# EAGLE design Xpander3-VIC (EAGLE 5.11)
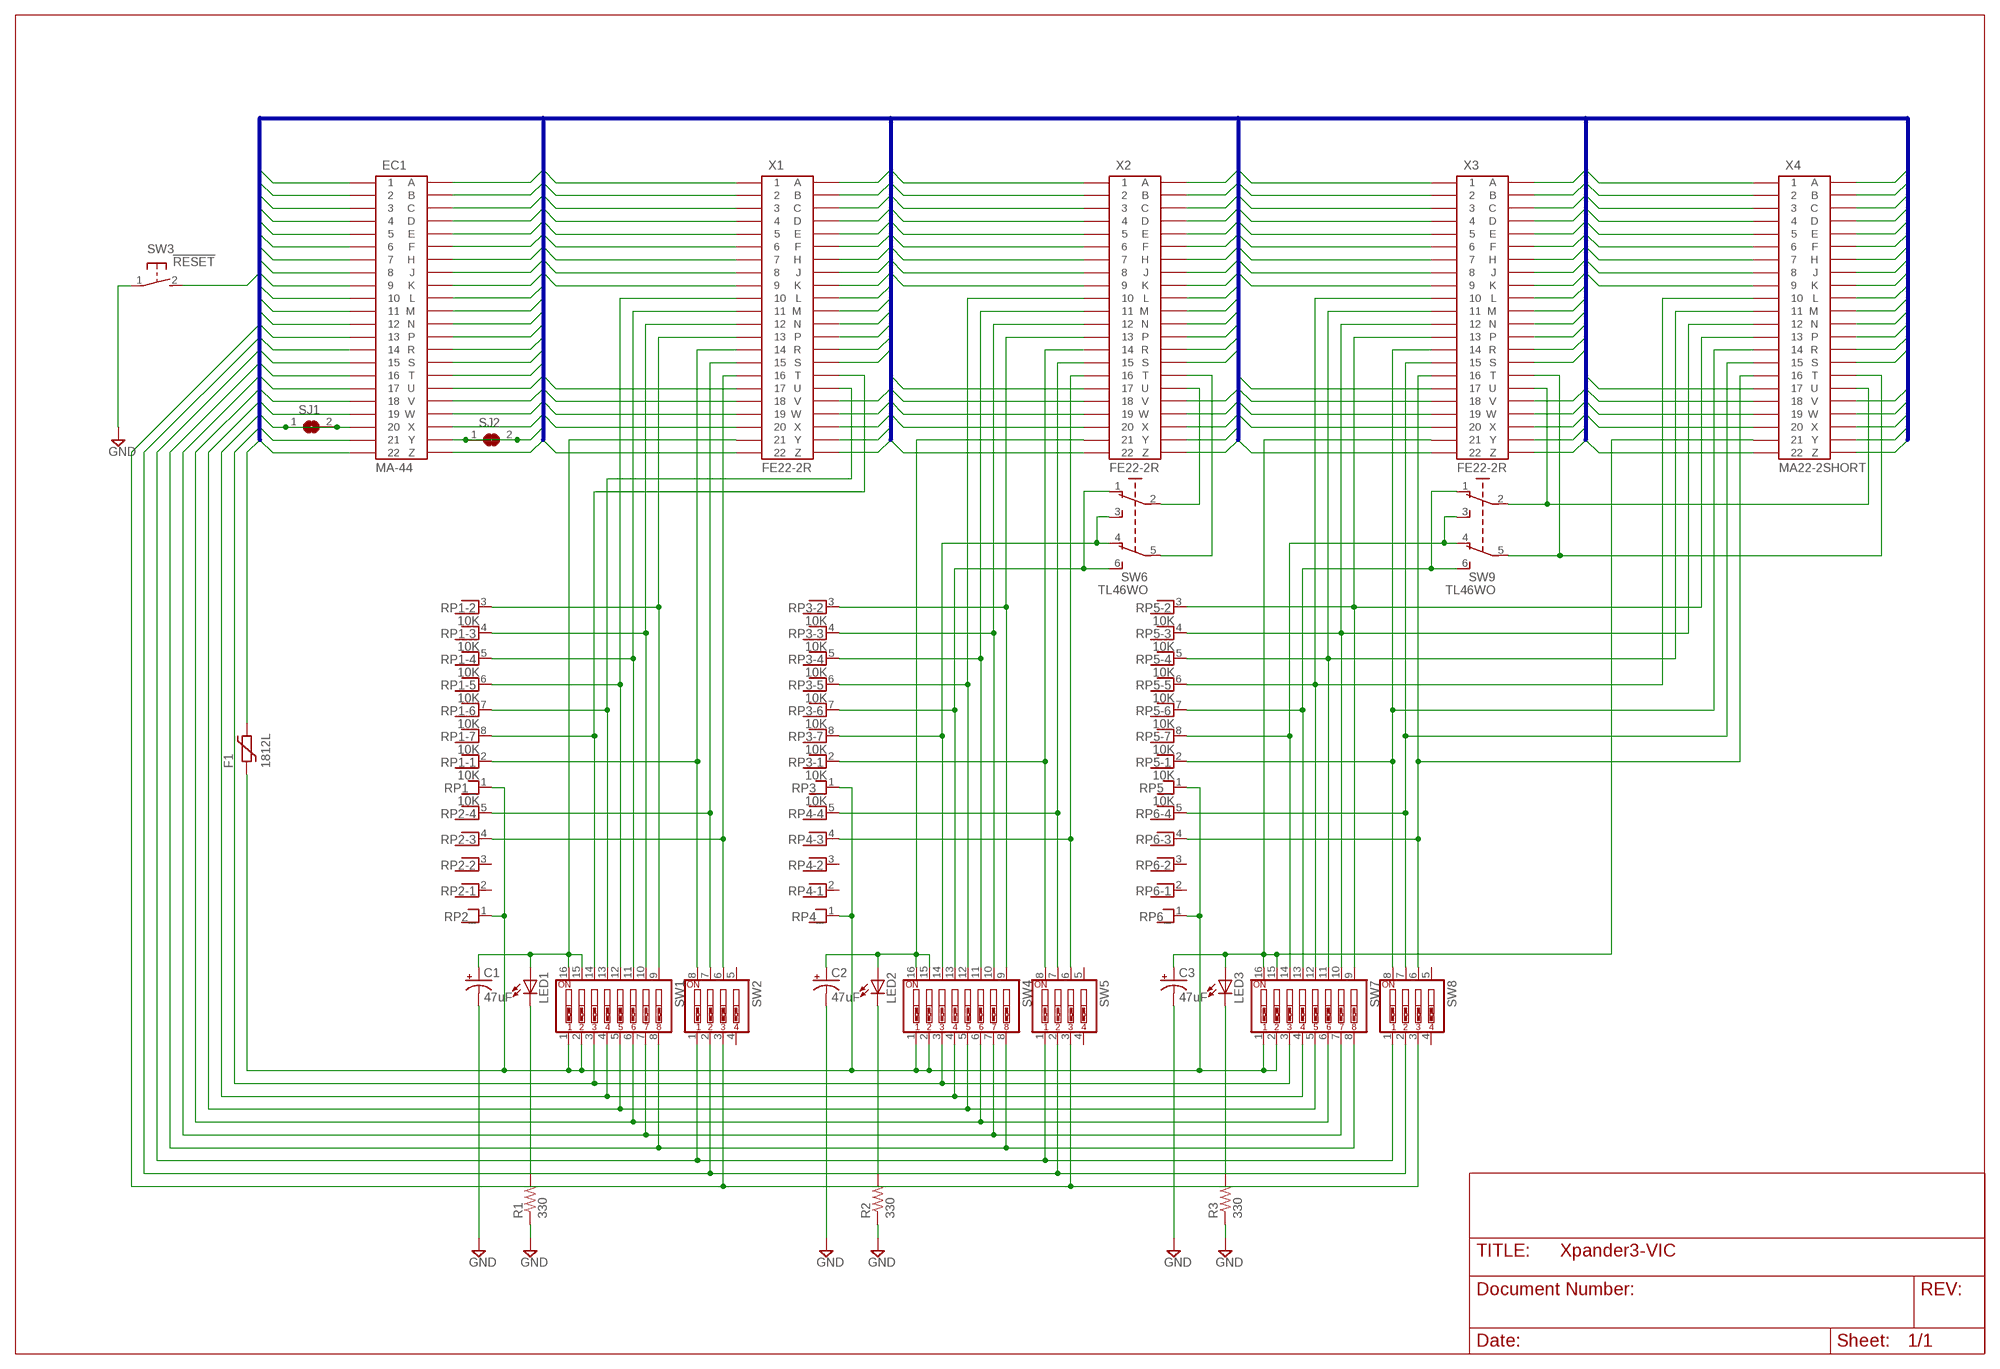
[diagram p0: schematic, sheet 1]

## Parts
C1  47uF  CPOL-USE2,5-6E  [E2,5-6E]
C2  47uF  CPOL-USE2,5-6E  [E2,5-6E]
C3  47uF  CPOL-USE2,5-6E  [E2,5-6E]
EC1  MA-44  [MA-44]
F1  1812L  [1812L]
LED1  LED3MM  [LED3MM]
LED2  LED3MM  [LED3MM]
LED3  LED3MM  [LED3MM]
R1  330  R-US_0204/7  [0204/7]
R2  330  R-US_0204/7  [0204/7]
R3  330  R-US_0204/7  [0204/7]
RP1  10K  RNX7  [RN-8]
RP2  RNX4  [RN-5]
RP3  10K  RNX7  [RN-8]
RP4  RNX4  [RN-5]
RP5  10K  RNX7  [RN-8]
RP6  RNX4  [RN-5]
SJ1  SJ  [SJ]
SJ2  SJ  [SJ]
SW1  SW_DIP-8  [EDG-08]
SW2  SW_DIP-4  [EDG-04]
SW3  !RESET  31-XX  [B3F-31XX]
SW4  SW_DIP-8  [EDG-08]
SW5  SW_DIP-4  [EDG-04]
SW6  TL46WO  [TL4XWO]
SW7  SW_DIP-8  [EDG-08]
SW8  SW_DIP-4  [EDG-04]
SW9  TL46WO  [TL4XWO]
X1  FE22-2R  [FE22-2_REV]
X2  FE22-2R  [FE22-2_REV]
X3  FE22-2R  [FE22-2_REV]
X4  MA22-2SHORT  [MA22-2SHORT]

## Nets
2: EC1.2 X1.2 X2.2 X3.2 X4.2
3: EC1.3 X1.3 X2.3 X3.3 X4.3
4: EC1.4 X1.4 X2.4 X3.4 X4.4
5: EC1.5 X1.5 X2.5 X3.5 X4.5
6: EC1.6 X1.6 X2.6 X3.6 X4.6
7: EC1.7 X1.7 X2.7 X3.7 X4.7
8: EC1.8 X1.8 X2.8 X3.8 X4.8
9: EC1.9 X1.9 X2.9 X3.9 X4.9
10: EC1.10 SW1.5 SW4.5 SW7.5
11: EC1.11 SW1.6 SW4.6 SW7.6
12: EC1.12 SW1.7 SW4.7 SW7.7
13: EC1.13 SW1.8 SW4.8 SW7.8
14: EC1.14 SW2.1 SW5.1 SW8.1
15: EC1.15 SW2.2 SW5.2 SW8.2
16: EC1.16 SW2.3 SW5.3 SW8.3
17: EC1.17 X1.17 X2.17 X3.17 X4.17
18: EC1.18 X1.18 X2.18 X3.18 X4.18
19: EC1.19 X1.19 X2.19 X3.19 X4.19
20: EC1.20 SJ1.1 SJ1.2 X1.20 X2.20 X3.20 X4.20
21: EC1.21 F1.P$2
B: EC1.B X1.B X2.B X3.B X4.B
C: EC1.C X1.C X2.C X3.C X4.C
D: EC1.D X1.D X2.D X3.D X4.D
E: EC1.E X1.E X2.E X3.E X4.E
F: EC1.F X1.F X2.F X3.F X4.F
FVCC: F1.P$1 RP1.1 RP2.1 RP3.1 RP4.1 RP5.1 RP6.1 SW1.1 SW1.2 SW4.1 SW4.2 SW7.1 SW7.2
GND: C1.- C2.- C3.- EC1.1 EC1.22 EC1.A EC1.Z R1.1 R2.1 R3.1 SW3.1(P) X1.1 X1.22 X1.A X1.Z X2.1 X2.22 X2.A X2.Z X3.1 X3.22 X3.A X3.Z X4.1 X4.22 X4.A X4.Z
H: EC1.H X1.H X2.H X3.H X4.H
J: EC1.J X1.J X2.J X3.J X4.J
K: EC1.K X1.K X2.K X3.K X4.K
L: EC1.L X1.L X2.L X3.L X4.L
M: EC1.M X1.M X2.M X3.M X4.M
N: EC1.N X1.N X2.N X3.N X4.N
N$1: RP1.6 SW1.12 X1.10
N$2: RP1.8 SW1.14 X1.T
N$3: RP1.7 SW1.13 X1.U
N$4: RP1.5 SW1.11 X1.11
N$5: RP1.4 SW1.10 X1.12
N$6: RP1.3 SW1.9 X1.13
N$7: C1.+ LED1.A SW1.15 SW1.16 X1.21
N$8: C2.+ LED2.A SW4.15 SW4.16 X2.21
N$9: RP3.6 SW4.12 X2.10
N$10: RP3.4 SW4.10 X2.12
N$11: RP5.2 SW8.8 X3.14 X4.14
N$12: RP3.7 SW4.13 SW6.1(O) SW6.6(S1)
N$13: RP3.8 SW4.14 SW6.3(S) SW6.4(O1)
N$14: RP6.5 SW8.7 X3.15 X4.15
N$15: RP3.3 SW4.9 X2.13
N$16: RP3.5 SW4.11 X2.11
N$17: LED1.K(C) R1.2
N$18: RP5.7 SW7.13 SW9.1(O) SW9.6(S1)
N$19: SW6.5(P1) X2.T
N$20: RP5.4 SW7.10 X3.12 X4.12
N$21: RP5.3 SW7.9 X3.13 X4.13
N$22: C3.+ LED3.A SW7.15 SW7.16 X3.21 X4.21
N$23: SW6.2(P) X2.U
N$24: RP5.8 SW7.14 SW9.3(S) SW9.4(O1)
N$25: LED2.K(C) R2.2
N$26: LED3.K(C) R3.2
N$27: SW9.2(P) X3.U X4.U
N$28: SW9.5(P1) X3.T X4.T
N$29: RP5.6 SW7.12 X3.10 X4.10
N$30: RP5.5 SW7.11 X3.11 X4.11
N$31: RP1.2 SW2.8 X1.14
N$32: RP2.5 SW2.7 X1.15
N$33: RP2.4 SW2.6 X1.16
N$34: RP3.2 SW5.8 X2.14
N$35: RP4.5 SW5.7 X2.15
N$36: RP4.4 SW5.6 X2.16
N$39: RP6.4 SW8.6 X3.16 X4.16
P: EC1.P X1.P X2.P X3.P X4.P
R: EC1.R X1.R X2.R X3.R X4.R
S: EC1.S X1.S X2.S X3.S X4.S
T: EC1.T SW1.3 SW4.3 SW7.3
U: EC1.U SW1.4 SW4.4 SW7.4
V: EC1.V X1.V X2.V X3.V X4.V
W: EC1.W X1.W X2.W X3.W X4.W
X: EC1.X SW3.2(S) X1.X X2.X X3.X X4.X
Y: EC1.Y SJ2.1 SJ2.2 X1.Y X2.Y X3.Y X4.Y
Unconnected: RP2.2 RP2.3 RP4.2 RP4.3 RP6.2 RP6.3 SW2.4 SW2.5 SW5.4 SW5.5 SW8.4 SW8.5

## Buses
GND,VCC,1,2,3,4,5,6,7,8,9,10,11,12,13,14,15,16,17,18,19,20,21,B,C,D,E,F,H,J,K,L,M,N,P,R,S,T,U,V,W,X,Y

## Library data of the parts
C1-C3 = rcl:CPOL-US: POLARIZED CAPACITOR, American symbol
EC1 = con-edge-156:MA-44: 44 PIN EDGE CONNECTOR FOR PCB
F1 = ptc-littlefuse:1812L
LED1-LED3 = led:LED: LED OSRAM: - CHIPLED LG R971, LG N971, LY N971, LG Q971, LY Q971, LO R971, LY R971 LH N974, LH R974 LS Q976, LO Q976, LY Q976 LO Q996 - Hyper CHIPLED LW Q18S LB Q993, LB Q99A, LB R99A - SideLED LS A670, LO A670, LY A670, LG A670, LP A670 LB A673, LV A673, LT A673, LW A673 LH A674 LY A675 LS A676, LA A676, LO A676, LY A676, LW A676 LS A679, LY A679, LG A679 - Hyper Micro SIDELED® LS Y876, LA Y876, LO Y876, LY Y876 LT Y87S - SmartLED LW L88C, LW L88S LB L89C, LB L89S, LG L890 LS L89K, LO L89K, LY L89K LS L896, LA L896, LO L896, LY L896 - TOPLED LS T670, LO T670, LY T670, LG T670, LP T670 LSG T670, LSP T670, LSY T670, LOP T670, LYG T670 LG T671, LOG T671, LSG T671 LB T673, LV T673, LT T673, LW T673 LH T674 LS T676, LA T676, LO T676, LY T676, LB T676, LH T676, LSB T676, LW T676 LB T67C, LV T67C, LT T67C, LS T67K, LO T67K, LY T67K, LW E67C LS E67B, LA E67B, LO E67B, LY E67B, LB E67C, LV E67C, LT E67C LW T67C LS T679, LY T679, LG T679 LS T770, LO T770, LY T770, LG T770, LP T770 LB T773, LV T773, LT T773, LW T773 LH T774 LS E675, LA E675, LY E675, LS T675 LS T776, LA T776, LO T776, LY T776, LB T776 LHGB T686 LT T68C, LB T68C - Hyper Mini TOPLED® LB M676 - Mini TOPLED Santana® LG M470 LS M47K, LO M47K, LY M47K Source: http://www.osram.convergy.de LUXEON: - LUMILED® LXK2-PW12-R00, LXK2-PW12-S00, LXK2-PW14-U00, LXK2-PW14-V00 LXK2-PM12-R00, LXK2-PM12-S00, LXK2-PM14-U00 LXK2-PE12-Q00, LXK2-PE12-R00, LXK2-PE12-S00, LXK2-PE14-T00, LXK2-PE14-U00 LXK2-PB12-K00, LXK2-PB12-L00, LXK2-PB12-M00, LXK2-PB14-N00, LXK2-PB14-P00, LXK2-PB14-Q00 LXK2-PR12-L00, LXK2-PR12-M00, LXK2-PR14-Q00, LXK2-PR14-R00 LXK2-PD12-Q00, LXK2-PD12-R00, LXK2-PD12-S00 LXK2-PH12-R00, LXK2-PH12-S00 LXK2-PL12-P00, LXK2-PL12-Q00, LXK2-PL12-R00 Source: www.luxeon.com KINGBRIGHT: KA-3528ASYC Source: www.kingbright.com
R1-R3 = rcl:R-US_: RESISTOR, American symbol
RP1 RP3 RP5 = resistor-net:RNX7: RESISTOR NETWORK; OC_FARNELL: unknown; OC_NEWARK: unknown
RP2 RP4 RP6 = resistor-net:RNX4: RESISTOR NETWORK; OC_FARNELL: unknown; OC_NEWARK: unknown
SJ1 SJ2 = jumper:SJ: SMD solder JUMPER
SW1 SW4 SW7 = special:SW_DIP-8: DIP SWITCH
SW2 SW5 SW8 = special:SW_DIP-4: DIP SWITCH
SW3 = switch-omron:31-XX: OMRON SWITCH; MPN: B3F-3100; OC_FARNELL: 959704; OC_NEWARK: 36M3582
SW6 SW9 = switch:TL46WO: TINY SWITCH ON - ON Source: http://www2.produktinfo.conrad.com/datenblaetter/700000-724999/705152-da-01-de-Subminiaturschalter_TL_36WO.pdf
X1-X3 = con-edge-156:FE22-2
X4 = con-edge-156:MA22-2SHORT

## Board
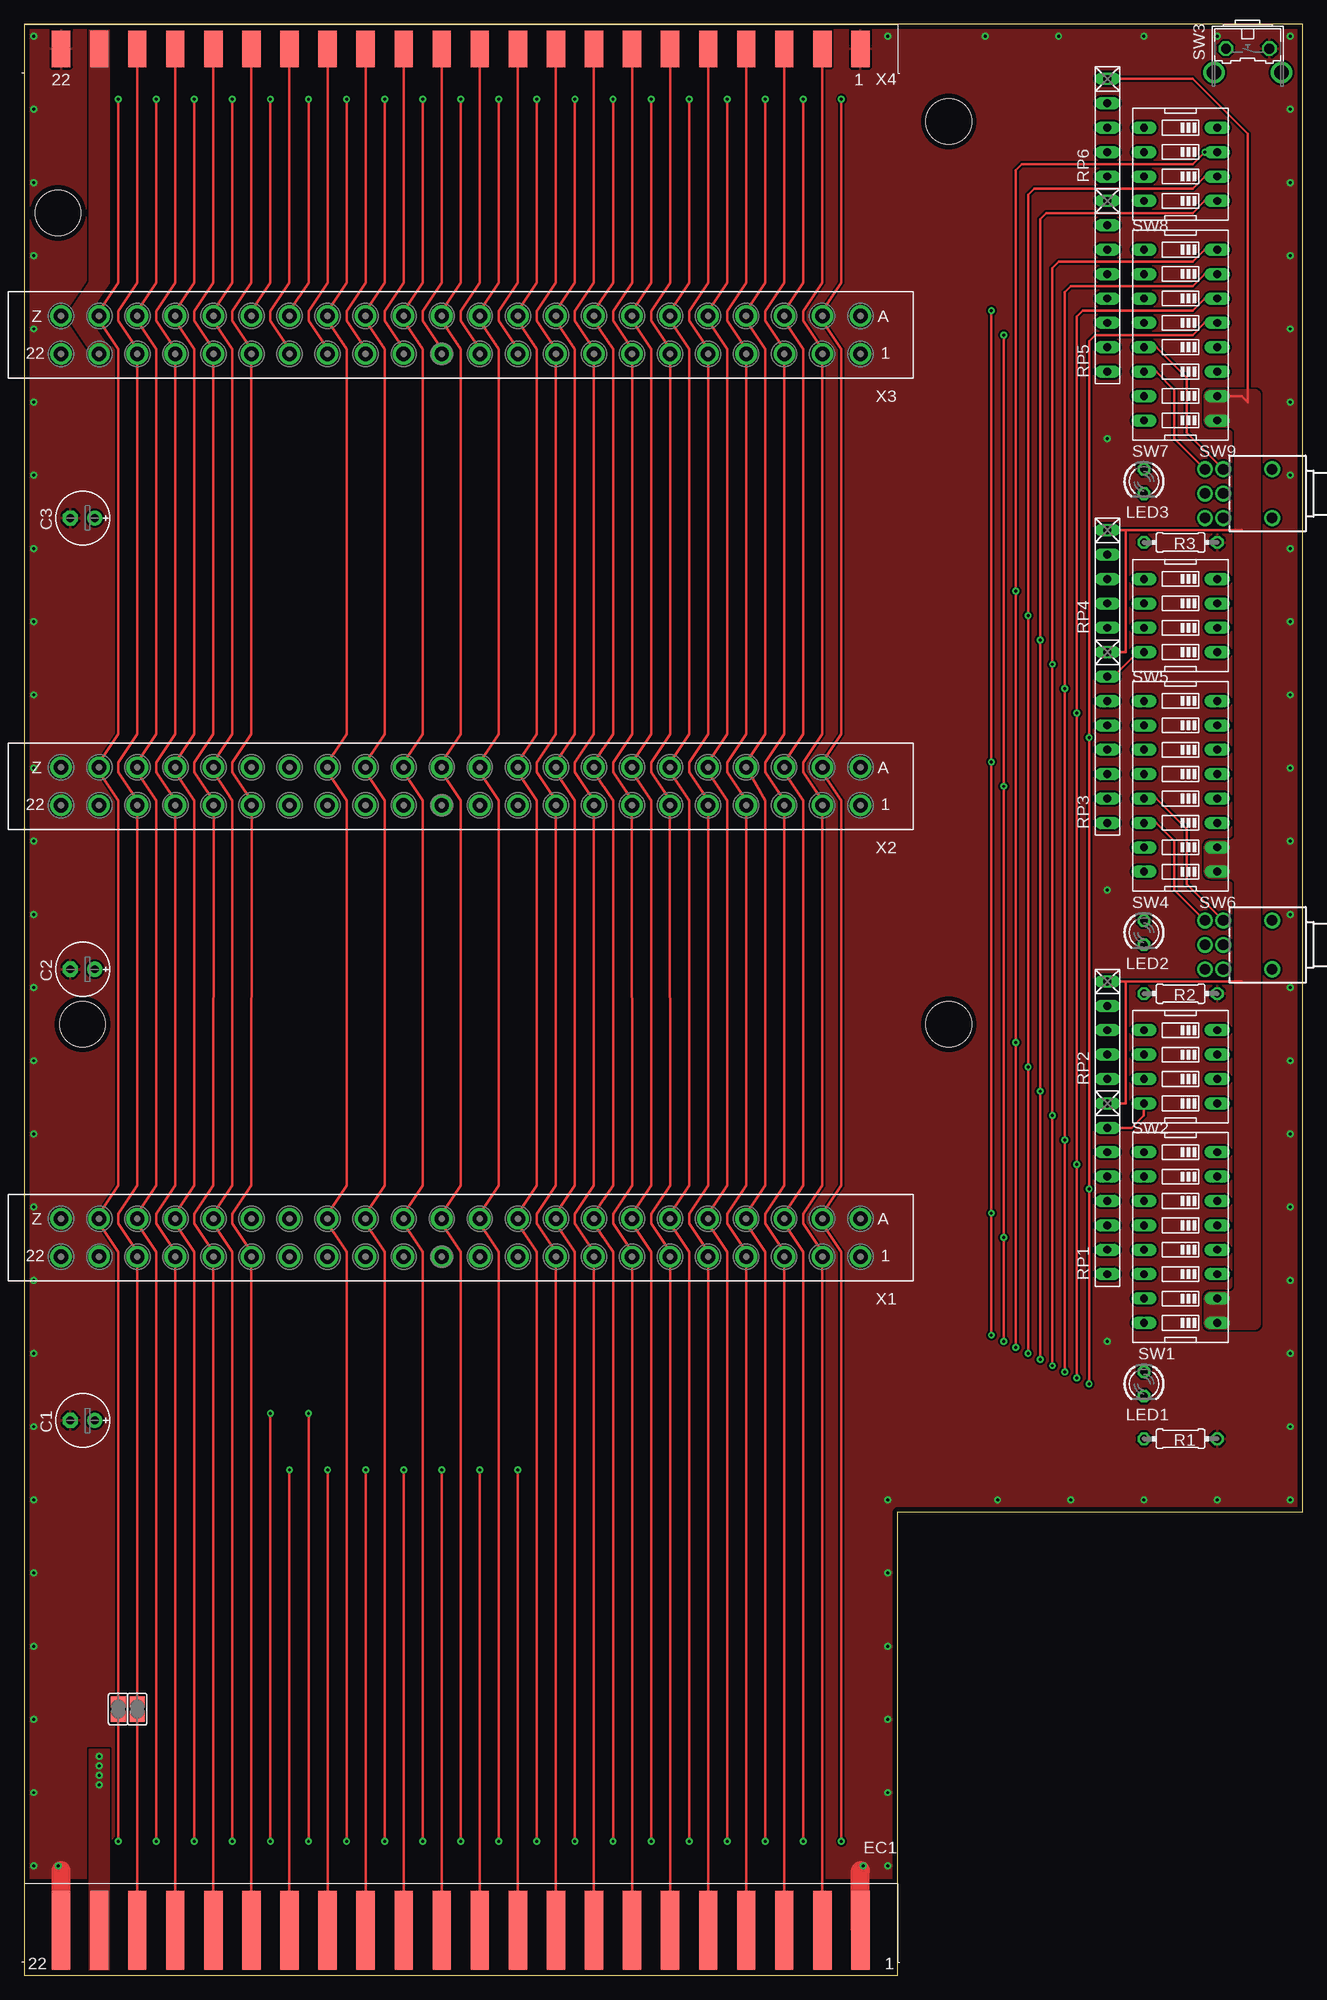
[diagram p1: board, top side]
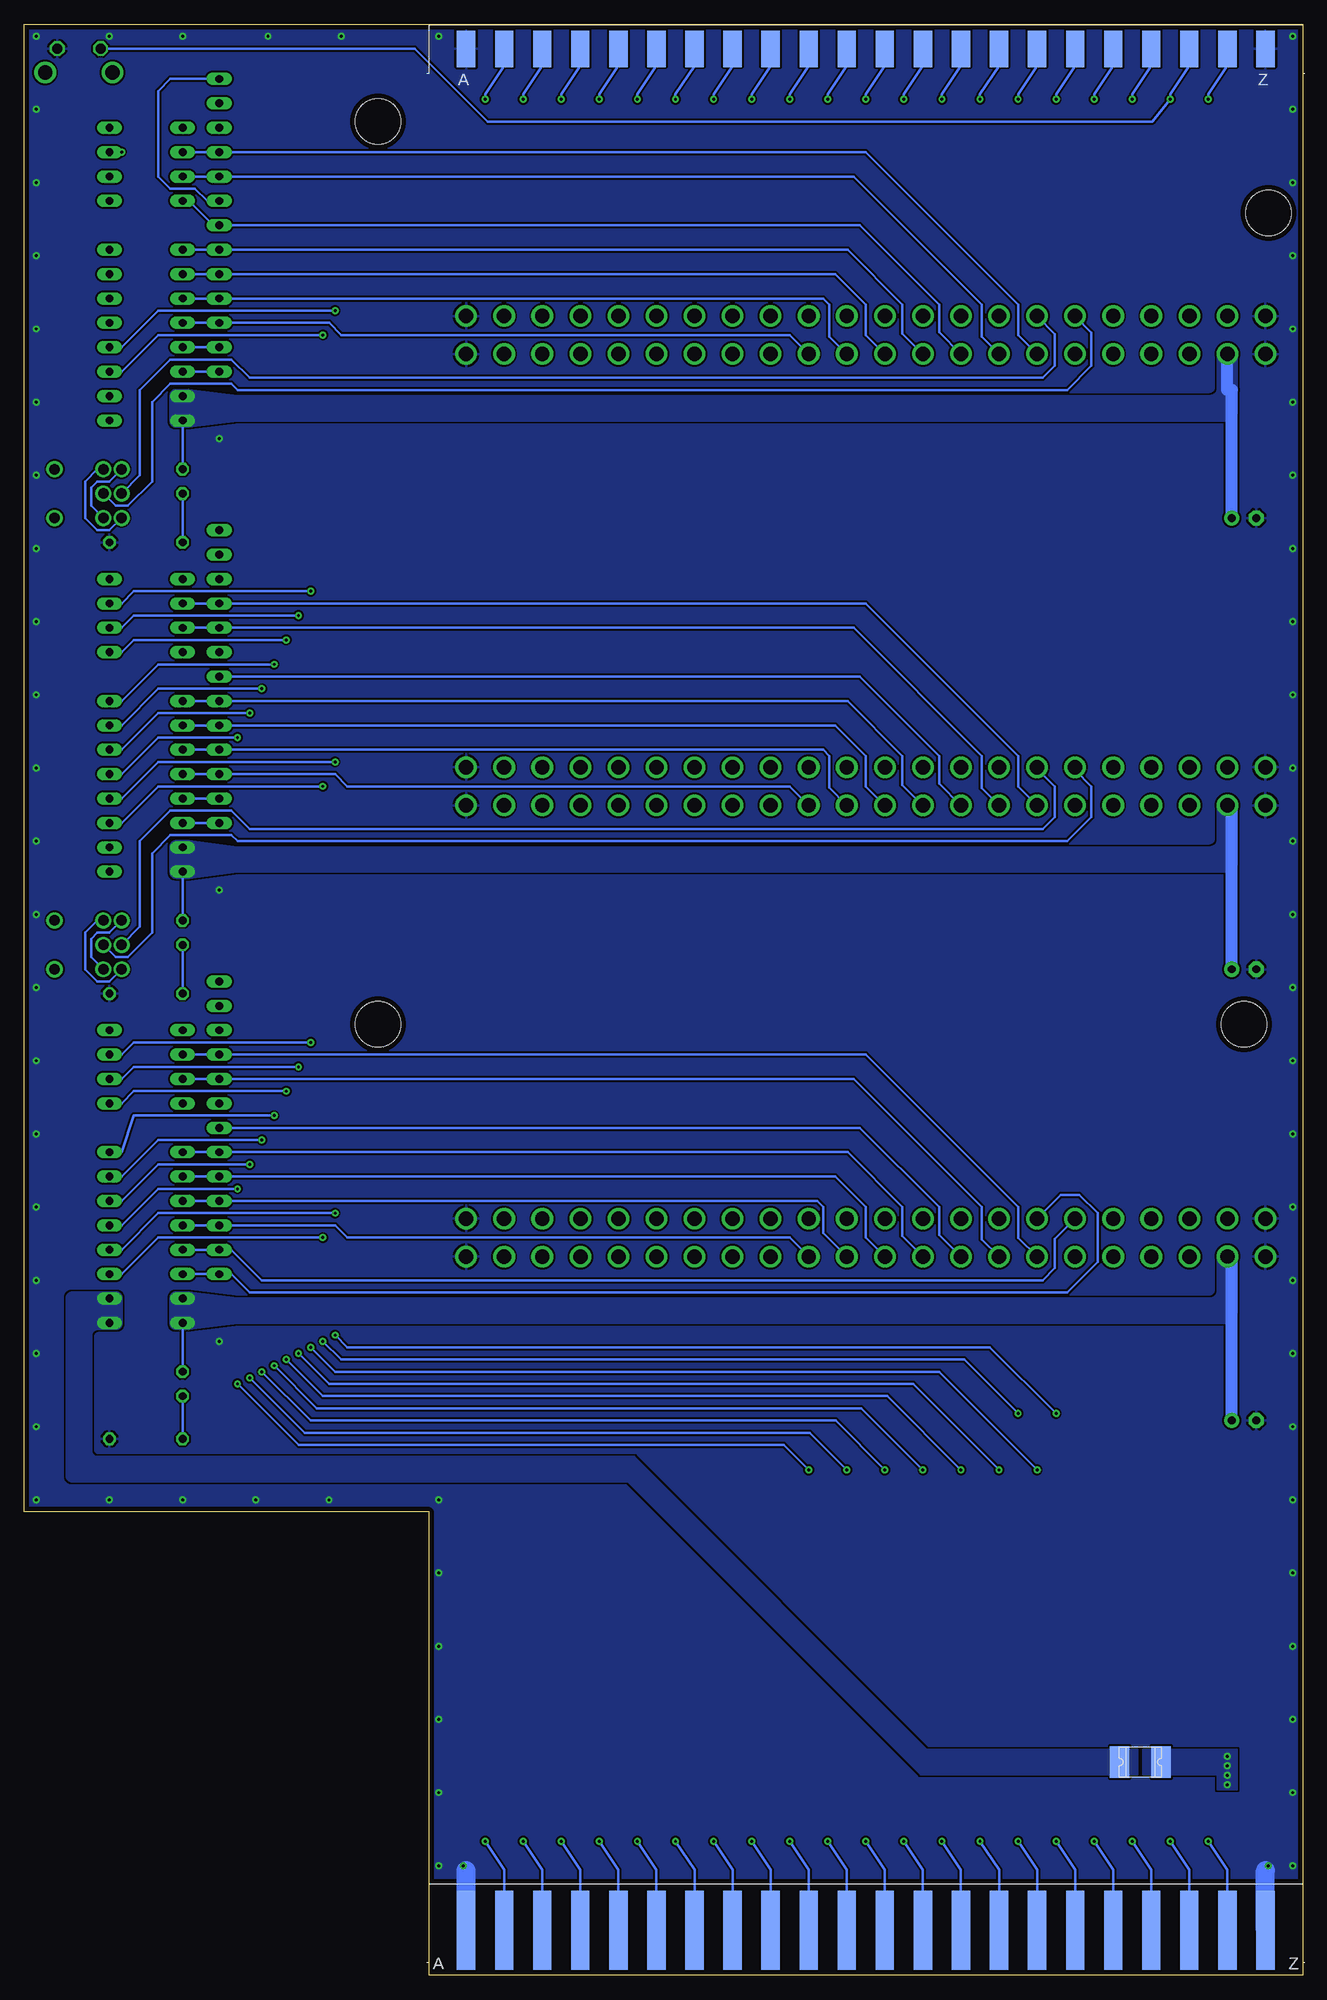
[diagram p2: board, bottom side, seen from below]

Size 133.1 x 203.2 mm. Coordinates in mm from the lower left corner, seen from the top.
Outline: 90.93,0 90.93,48.26 133.1,48.26 133.1,203.2 0,203.2 0,0 90.93,0
Copper layers (1*16): Top 0.035mm / dielectric 1.5mm / Bottom 0.035mm
Design rules "ourpcb-small *": minimum track width 8mil, minimum drill 12mil, track to track 8mil, track to pad 8mil, pad to pad 8mil, via to via 8mil, smd to smd 0mil, copper to edge 20mil, drill to drill 8mil, minimum pad ring 10mil, minimum via ring 8mil, stop-mask expansion 4mil, vias tented up to drill 0mil, thermal gap 10mil
Holes 4.75 mm at 96.27,99.06 96.27,193.04 3.56,183.51 6.1,99.06

### Footprints (pad centres in the part's own frame; a part is rotated, then mirrored left to right if it is on the bottom)
E2,5-6E = drill 0.813 pad 1.575 round: + -1.27,0 | drill 0.813 pad 1.575 octagon: - 1.27,0
MA-44 = smd 1.905 x 8.255: 1 -41.605,4.826; 2 -37.643,4.826; 3 -33.68,4.826; 4 -29.718,4.826; 5 -25.756,4.826; 6 -21.793,4.826; 7 -17.831,4.826; 8 -13.868,4.826; 9 -9.906,4.826; 10 -5.944,4.826; 11 -1.981,4.826; 12 1.981,4.826; 13 5.944,4.826; 14 9.906,4.826; 15 13.868,4.826; 16 17.831,4.826; 17 21.793,4.826; 18 25.756,4.826; 19 29.718,4.826; 20 33.68,4.826; 21 37.643,4.826; 22 41.605,4.826 | smd 1.905 x 8.255 bottom: A -41.605,4.826; B -37.643,4.826; C -33.68,4.826; D -29.718,4.826; E -25.756,4.826; F -21.793,4.826; H -17.831,4.826; J -13.868,4.826; K -9.906,4.826; L -5.944,4.826; M -1.981,4.826; N 1.981,4.826; P 5.944,4.826; R 9.906,4.826; S 13.868,4.826; T 17.831,4.826; U 21.793,4.826; V 25.756,4.826; W 29.718,4.826; X 33.68,4.826; Y 37.643,4.826; Z 41.605,4.826
1812L = smd 2.03 x 3.3: P$1 -2.16,0; P$2 2.16,0
LED3MM = drill 0.813 octagon: A -1.27,0; K 1.27,0
0204/7 = drill 0.813 octagon: 1 -3.81,0; 2 3.81,0
RN-8 = drill 0.813 long: 1 -8.89,0; 2 -6.35,0; 3 -3.81,0; 4 -1.27,0; 5 1.27,0; 6 3.81,0; 7 6.35,0; 8 8.89,0
RN-5 = drill 0.813 long: 1 -5.08,0; 2 -2.54,0; 3 0,0; 4 2.54,0; 5 5.08,0
SJ = smd 1.168 x 1.6: 1 -0.762,0; 2 0.762,0
EDG-08 = drill 0.813 long: 1 -8.89,-3.81; 2 -6.35,-3.81; 3 -3.81,-3.81; 4 -1.27,-3.81; 5 1.27,-3.81; 6 3.81,-3.81; 7 6.35,-3.81; 8 8.89,-3.81; 9 8.89,3.81; 10 6.35,3.81; 11 3.81,3.81; 12 1.27,3.81; 13 -1.27,3.81; 14 -3.81,3.81; 15 -6.35,3.81; 16 -8.89,3.81
EDG-04 = drill 0.813 long: 1 -3.81,-3.81; 2 -1.27,-3.81; 3 1.27,-3.81; 4 3.81,-3.81; 5 3.81,3.81; 6 1.27,3.81; 7 -1.27,3.81; 8 -3.81,3.81
B3F-31XX = drill 1.016 octagon: 1 -2.261,-1.245; 2 2.261,-1.245 | drill 1.499 pad 2.159 round: 3 -3.505,1.245; 4 3.505,1.245
TL4XWO = drill 1.1 pad 1.422 round: 1 -2.54,-5.08; 2 0,-5.08; 3 2.54,-5.08; 4 -2.54,-6.985; 5 0,-6.985; 6 2.54,-6.985 | drill 1.1 pad 1.676 round: M1 -2.54,0; M2 2.54,0
FE22-2_REV = drill 1.5 round: 1 -41.605,1.981; 2 -37.643,1.981; 3 -33.68,1.981; 4 -29.718,1.981; 5 -25.756,1.981; 6 -21.793,1.981; 7 -17.831,1.981; 8 -13.868,1.981; 9 -9.906,1.981; 10 -5.944,1.981; 11 -1.981,1.981; 12 1.981,1.981; 13 5.944,1.981; 14 9.906,1.981; 15 13.868,1.981; 16 17.831,1.981; 17 21.793,1.981; 18 25.756,1.981; 19 29.718,1.981; 20 33.68,1.981; 21 37.644,1.958; 22 41.605,1.98; A -41.605,-1.981; B -37.643,-1.981; C -33.68,-1.981; D -29.718,-1.981; E -25.756,-1.981; F -21.793,-1.981; H -17.831,-1.981; J -13.868,-1.981; K -9.906,-1.981; L -5.944,-1.981; M -1.981,-1.981; N 1.981,-1.981; P 5.944,-1.981; R 9.906,-1.981; S 13.868,-1.981; T 17.831,-1.981; U 21.793,-1.981; V 25.756,-1.981; W 29.718,-1.981; X 33.68,-1.981; Y 37.643,-1.981; Z 41.605,-1.981
MA22-2SHORT = smd 1.905 x 3.81: 1 -41.605,0; 2 -37.643,0; 3 -33.68,0; 4 -29.718,0; 5 -25.756,0; 6 -21.793,0; 7 -17.831,0; 8 -13.868,0; 9 -9.906,0; 10 -5.944,0; 11 -1.981,0; 12 1.981,0; 13 5.944,0; 14 9.906,0; 15 13.868,0; 16 17.831,0; 17 21.793,0; 18 25.756,0; 19 29.718,0; 20 33.68,0; 21 37.643,0; 22 41.605,0 | smd 1.905 x 3.81 bottom: A -41.605,0; B -37.643,0; C -33.68,0; D -29.718,0; E -25.756,0; F -21.793,0; H -17.831,0; J -13.868,0; K -9.906,0; L -5.944,0; M -1.981,0; N 1.981,0; P 5.944,0; R 9.906,0; S 13.868,0; T 17.831,0; U 21.793,0; V 25.756,0; W 29.718,0; X 33.68,0; Y 37.643,0; Z 41.605,0

### Placement (x,y rotation side)
C1  6.1,57.78 180 top
C2  6.1,104.78 180 top
C3  6.1,151.76 180 top
EC1  45.47,9.53 180 top
F1  16.89,22.23 0 bottom
LED1  116.59,61.59 270 top
LED2  116.59,108.58 270 top
LED3  116.59,155.57 270 top
R1  120.4,55.88 180 top
R2  120.4,102.23 180 top
R3  120.4,149.22 180 top
RP1  112.78,81.92 270 top
RP2  112.78,98.42 270 top
RP3  112.78,128.91 270 top
RP4  112.78,145.41 270 top
RP5  112.78,175.9 270 top
RP6  112.78,192.41 270 top
SJ1  11.79,27.74 270 top
SJ2  9.8,27.74 270 top
SW1  120.4,76.83 90 top
SW2  120.4,94.61 90 top
SW3  127.38,199.39 180 top
SW4  120.4,123.83 90 top
SW5  120.4,141.6 90 top
SW6  129.92,107.31 270 top
SW7  120.4,170.81 90 top
SW8  120.4,188.59 90 top
SW9  129.92,154.31 270 top
X1  45.47,76.83 180 top
X2  45.47,123.83 180 top
X3  45.47,170.81 180 top
X4  45.47,200.61 180 top

### Tracks (layer width: path | path; a pad name or v marks a point on that pad's centre or on a via)
2
  Top 0.254: X4.2 83.11,176.26 81.13,173.29 81.13,172.3 83.11,169.33 X3.2 83.11,129.27 81.13,126.3 81.13,125.31 83.11,122.34 X2.2 83.11,82.28 81.13,79.31 81.13,78.32 83.11,75.35 83.09,75.33 X1.2 83.09,74.38 83.11,74.36 EC1.2
3
  Top 0.254: X4.3 79.15,176.26 77.16,173.29 77.16,172.3 79.15,169.33 X3.3 79.15,129.27 77.16,126.3 77.16,125.31 79.15,122.34 X2.3 79.13,121.37 79.15,82.28 77.16,79.31 77.16,78.32 79.15,75.35 79.13,75.33 X1.3 79.13,74.38 79.15,74.36 EC1.3
4
  Top 0.254: X4.4 75.18,176.26 73.2,173.29 73.2,172.3 75.18,169.33 X3.4 75.18,129.27 73.2,126.3 73.2,125.31 75.18,122.34 X2.4 75.17,121.37 75.18,82.28 73.2,79.31 73.2,78.32 75.18,75.35 75.17,75.33 X1.4 75.17,74.38 75.18,74.36 EC1.4
5
  Top 0.254: X4.5 71.22,176.26 69.24,173.29 69.24,172.3 71.22,169.33 X3.5 71.22,129.27 69.24,126.3 69.24,125.31 71.22,122.34 X2.5 71.21,121.36 71.22,82.28 69.24,79.31 69.24,78.32 71.22,75.35 71.21,75.33 X1.5 71.21,74.37 71.22,74.36 EC1.5
6
  Top 0.254: X4.6 67.26,176.26 65.28,173.29 65.28,172.3 67.26,169.33 X3.6 67.26,129.27 65.28,126.3 65.28,125.31 67.26,122.34 X2.6 67.25,121.36 67.26,82.28 65.28,79.31 65.28,78.32 67.26,75.35 67.25,75.34 X1.6 67.25,74.37 67.26,74.36 EC1.6
7
  Top 0.254: X4.7 63.3,176.26 61.32,173.29 61.32,172.3 63.3,169.33 X3.7 63.3,129.27 61.32,126.3 61.32,125.31 63.3,122.34 X2.7 63.29,121.36 63.3,82.28 61.32,79.31 61.32,78.32 63.3,75.35 X1.7 63.29,74.37 63.3,74.36 EC1.7
8
  Top 0.254: X4.8 59.33,176.26 57.35,173.29 57.35,172.3 59.33,169.33 X3.8 59.33,129.27 57.35,126.3 57.35,125.31 59.33,122.34 X2.8 59.33,121.36 59.33,82.28 57.35,79.31 57.35,78.32 59.33,75.35 59.33,75.34 X1.8 59.33,74.37 59.33,74.36 EC1.8
9
  Top 0.254: X4.9 55.37,176.26 53.39,173.29 53.39,172.3 55.37,169.33 X3.9 55.37,129.27 53.39,126.3 53.39,125.31 55.37,122.34 X2.9 55.37,82.28 53.39,79.31 53.39,78.32 55.37,75.35 X1.9 55.37,74.36 EC1.9
10  (via drill 0.3)
  Top 0.254: v51.41,52.65 EC1.10 | v110.87,61.59 v110.87,81.92 v110.87,128.91 110.87,170.18 111.51,170.81 121.67,170.81 122.94,172.09 SW7.5
  Bottom 0.254: v110.87,61.59 104.52,55.24 54,55.24 v51.41,52.65 | SW1.5 122.94,78.11 119.13,81.92 v110.87,81.92 | SW4.5 122.94,125.09 119.13,128.91 v110.87,128.91
11  (via drill 0.3)
  Top 0.254: v47.45,52.65 EC1.11 | v109.6,62.23 v109.6,84.45 v109.6,131.44 109.6,172.72 110.24,173.35 121.67,173.35 122.94,174.62 SW7.6
  Bottom 0.254: v109.6,62.23 103.89,56.52 51.31,56.52 v47.45,52.65 | SW1.6 122.94,80.64 119.13,84.45 v109.6,84.45 | SW4.6 122.94,127.64 119.13,131.44 v109.6,131.44
12  (via drill 0.3)
  Top 0.254: v43.48,52.65 EC1.12 | v108.33,62.87 v108.33,87 v108.33,133.99 108.33,175.26 108.97,175.9 121.67,175.9 122.94,177.16 SW7.7
  Bottom 0.254: v108.33,62.87 103.25,57.78 48.62,57.78 v43.48,52.65 | SW1.7 122.94,83.19 119.13,87 v108.33,87 | SW4.7 122.94,130.18 119.13,133.99 v108.33,133.99
13  (via drill 0.3)
  Top 0.254: v39.52,52.65 EC1.13 | v107.06,63.5 v107.06,89.53 v107.06,136.53 107.06,177.8 107.7,178.44 121.67,178.44 122.94,179.71 SW7.8
  Bottom 0.254: v107.06,63.5 102.62,59.05 45.92,59.05 v39.52,52.65 | SW1.8 122.94,85.72 121.67,89.53 v107.06,89.53 | SW4.8 122.94,132.72 119.13,136.53 v107.06,136.53
14  (via drill 0.3)
  Top 0.254: v35.56,52.65 EC1.14 | v105.79,64.14 v105.79,92.08 v105.79,139.06 105.79,182.88 106.43,183.51 121.67,183.51 122.94,184.78 SW8.1
  Bottom 0.254: v105.79,64.14 101.98,60.33 43.23,60.33 v35.56,52.65 | SW2.1 122.94,90.81 121.67,92.08 v105.79,92.08 | SW5.1 122.94,137.79 121.67,139.06 v105.79,139.06
15  (via drill 0.3)
  Top 0.254: v31.6,52.65 EC1.15 | v104.52,64.77 v104.52,94.61 v104.52,141.6 104.52,185.42 105.16,186.06 121.67,186.06 122.94,187.32 SW8.2
  Bottom 0.254: v104.52,64.77 101.35,61.59 40.54,61.59 v31.6,52.65 | SW2.2 122.94,93.34 121.67,94.61 v104.52,94.61 | SW5.2 122.94,140.34 121.67,141.6 v104.52,141.6
16  (via drill 0.3)
  Top 0.254: v27.63,52.65 EC1.16 | v103.25,65.41 v103.25,97.16 v103.25,144.15 103.25,187.96 103.89,188.59 121.67,188.59 v122.94,189.87
  Bottom 0.254: v103.25,65.41 100.71,62.87 37.85,62.87 v27.63,52.65 | SW2.3 122.94,95.89 121.67,97.16 v103.25,97.16 | SW5.3 122.94,142.88 121.67,144.15 v103.25,144.15 | v122.94,189.87 SW8.3
17
  Top 0.254: X4.17 23.67,176.26 21.69,173.29 21.69,172.3 23.67,169.33 X3.17 23.67,129.27 21.69,126.3 21.69,125.31 23.67,122.34 X2.17 23.69,121.36 23.67,82.28 21.69,79.31 21.69,78.32 23.67,75.35 23.69,75.34 X1.17 23.69,74.37 23.67,74.36 EC1.17
18
  Top 0.254: X4.18 19.71,176.26 17.73,173.29 17.73,172.3 19.71,169.33 X3.18 19.71,129.27 17.73,126.3 17.73,125.31 19.71,122.34 X2.18 19.73,121.36 19.71,82.28 17.73,79.31 17.73,78.32 19.71,75.35 19.73,75.33 X1.18 19.73,74.37 19.71,74.36 EC1.18
19
  Top 0.254: X4.19 15.75,176.26 13.77,173.29 13.77,172.3 15.75,169.33 X3.19 15.75,129.27 13.77,126.3 13.77,125.31 15.75,122.34 X2.19 15.77,121.37 15.75,82.28 13.77,79.31 13.77,78.32 15.75,75.35 X1.19 15.77,74.38 15.75,74.36 EC1.19
20
  Top 0.254: X4.20 11.79,176.26 9.8,173.29 9.8,172.3 11.79,169.33 X3.20 11.79,129.27 9.8,126.3 9.8,125.31 11.79,122.34 X2.20 11.81,121.37 11.79,82.28 9.8,79.31 9.8,78.32 11.79,75.35 X1.20 11.81,74.38 11.79,74.36 SJ1.1 SJ1.2 EC1.20
21  (via drill 0.3)
  other vias: 7.82,22.83 7.82,21.84 7.82,20.85 7.82,19.86
  pour Top (no thermals): 6.83,0.55 8.81,0.55 8.81,23.5 6.83,23.5
  pour Bottom (no thermals): 16.57,23.5 6.83,23.5 6.83,19.37 8.81,19.37 8.81,20.95 16.57,20.95
B  (via drill 0.3)
  Top 0.254: v85.09,195.38 85.09,176.26 83.11,173.29 X3.B 83.11,172.3 85.09,169.33 85.09,129.27 83.11,126.3 X2.B 83.09,125.33 83.11,125.31 85.09,122.34 85.09,82.28 83.11,79.31 83.09,79.29 X1.B 83.09,78.34 83.11,78.32 85.09,75.35 v85.09,13.97
  Bottom 0.254: 82.93,201.12 arc-90 83.09,200.96 X4.B 83.11,198.84 85.09,195.87 v85.09,195.38 | v85.09,13.97 83.11,11 EC1.B
C  (via drill 0.3)
  Top 0.254: v81.13,195.38 81.13,176.26 79.15,173.29 X3.C 79.15,172.3 81.13,169.33 81.13,129.27 79.15,126.3 X2.C 79.15,125.31 81.13,122.34 81.13,82.28 79.15,79.31 X1.C 79.13,78.34 79.15,78.32 81.13,75.35 v81.13,13.97
  Bottom 0.254: v81.13,195.38 81.13,195.87 79.15,198.84 X4.C | v81.13,13.97 79.15,11 EC1.C
D  (via drill 0.3)
  Top 0.254: v77.16,195.38 77.16,176.26 75.18,173.29 X3.D 75.18,172.3 77.16,169.33 77.16,129.27 75.18,126.3 X2.D 77.16,122.34 77.16,82.28 75.18,79.31 X1.D 75.17,78.34 75.18,78.32 77.16,75.35 v77.16,13.97
  Bottom 0.254: X4.D arc90 75.17,200.64 75.18,198.84 77.16,195.87 v77.16,195.38 | v77.16,13.97 75.18,11 EC1.D
E  (via drill 0.3)
  Top 0.254: v73.2,195.38 73.2,176.26 71.22,173.29 X3.E 71.22,172.3 73.2,169.33 73.2,129.27 71.22,126.3 X2.E 71.21,125.33 71.22,125.31 73.2,122.34 73.2,82.28 71.22,79.31 X1.E 71.21,78.34 71.22,78.32 73.2,75.35 v73.2,13.97
  Bottom 0.254: X4.E arc90 71.21,200.64 71.22,198.84 73.2,195.87 v73.2,195.38 | v73.2,13.97 71.22,11 EC1.E
F  (via drill 0.3)
  Top 0.254: v69.24,195.38 69.24,176.26 67.26,173.29 X3.F 67.26,172.3 69.24,169.33 69.24,129.27 67.26,126.3 X2.F 67.26,125.31 69.24,122.34 69.24,82.28 67.26,79.31 X1.F 67.25,78.33 67.26,78.32 69.24,75.35 v69.24,13.97
  Bottom 0.254: X4.F arc90 67.25,200.65 67.26,198.84 69.24,195.87 v69.24,195.38 | v69.24,13.97 67.26,11 EC1.F
FVCC
  Top 0.254: RP1.1 114.68,90.81 114.68,103.5 | RP3.1 114.68,137.79 114.68,150.5 | RP4.1 114.68,150.5 | 114.68,150.5 126.75,150.5 | 114.68,103.5 RP2.1 | 114.68,103.5 126.75,103.5 | SW7.2 126.75,164.47 127.38,163.83 127.38,191.77 121.67,197.49 RP6.1
  Bottom 0.254: RP5.1 114.05,184.78 115.32,186.06 117.86,186.06 119.13,187.32 119.13,196.22 117.86,197.49 RP6.1
  pour Bottom (no thermals): 17.21,23.5 39.12,23.5 69.6,53.98 125.48,53.98 arc90 126.11,54.61 126.11,66.67 arc90 125.48,67.31 123.57,67.31 arc-90 122.94,67.94 122.94,70.48 arc-90 123.57,71.12 128.02,71.12 arc-90 128.65,70.48 128.65,52.07 arc-90 128.02,51.44 70.23,51.44 39.75,20.95 17.21,20.95
  pour Top (no thermals): 123.57,67.31 arc-90 122.94,67.94 122.94,70.48 arc-90 123.57,71.12 125.48,71.12 arc90 126.11,71.75 126.11,113.67 arc90 125.48,114.3 123.57,114.3 arc-90 122.94,114.94 122.94,117.47 arc-90 123.57,118.11 125.48,118.11 arc90 126.11,118.75 126.11,160.66 arc90 125.48,161.29 123.57,161.29 arc-90 122.94,161.93 122.94,164.47 arc-90 123.57,165.1 128.02,165.1 arc-90 128.65,164.47 128.65,67.94 arc-90 128.02,67.31
GND  (via drill 0.3)
  Top 1.981: EC1.1 87.07,10.95 | EC1.Z 3.86,10.95
  Bottom 1.981: EC1.1 87.07,10.95 | EC1.Z 3.86,10.95
  other vias: 112.78,160.02 131.83,201.93 131.83,194.31 131.83,186.69 131.83,179.07 131.83,171.45 131.83,163.83 131.83,148.59 131.83,156.21 131.83,140.97 131.83,133.35 131.83,125.73 131.83,118.11 131.83,110.49 131.83,102.87 131.83,95.25 131.83,87.63 131.83,80.01 131.83,72.39 131.83,64.77 131.83,57.15 131.83,49.53 124.21,49.53 116.59,49.53 108.97,49.53 101.35,49.53 89.92,26.67 89.92,19.05 89.92,11.43 1.02,11.43 1.02,19.05 1.02,26.67 1.02,49.53 1.02,57.15 1.02,64.77 1.02,72.39 1.02,80.01 1.02,87.63 1.02,95.25 1.02,102.87 1.02,110.49 1.02,118.11 1.02,125.73 1.02,133.35 1.02,140.97 1.02,148.59 1.02,156.21 1.02,163.83 1.02,171.45 1.02,179.07 1.02,186.69 1.02,194.31 1.02,201.93 124.21,201.93 116.59,201.93 107.7,201.93 100.08,201.93 89.92,34.29 89.92,41.91 1.02,34.29 1.02,41.91 3.56,11.43 87.38,11.43 112.78,113.03 112.78,66.04 89.92,201.93 89.92,49.53
  pour Bottom (rank 2): 90.93,10.16 0,10.16 0,203.2 133.1,203.2 133.1,48.26 90.93,48.26
  pour Top (rank 2): 0,10.16 0,203.2 133.1,203.2 133.1,48.26 90.93,48.26 90.93,10.16
H  (via drill 0.3)
  Top 0.254: v65.28,195.38 65.28,176.26 63.3,173.29 X3.H 63.3,172.3 65.28,169.33 65.28,129.27 63.3,126.3 X2.H 63.29,125.32 63.3,125.31 65.28,122.34 65.28,82.28 63.3,79.31 X1.H 63.29,78.33 63.3,78.32 65.28,75.35 v65.28,13.97
  Bottom 0.254: X4.H arc90 63.29,200.65 63.3,198.84 65.28,195.87 v65.28,195.38 | v65.28,13.97 63.3,11 EC1.H
J  (via drill 0.3)
  Top 0.254: v61.32,195.38 61.32,176.26 59.33,173.29 X3.J 59.33,172.3 61.32,169.33 61.32,129.27 59.33,126.3 X2.J 59.33,125.31 61.32,122.34 61.32,82.28 59.33,79.31 X1.J 59.33,78.33 59.33,78.32 61.32,75.35 v61.32,13.97
  Bottom 0.254: X4.J arc90 59.33,200.65 59.33,198.84 61.32,195.87 v61.32,195.38 | v61.32,13.97 59.33,11 EC1.J
K  (via drill 0.3)
  Top 0.254: v57.35,195.38 57.35,176.26 55.37,173.29 X3.K 55.37,172.3 57.35,169.33 57.35,129.27 55.37,126.3 X2.K 55.37,125.32 55.37,125.31 57.35,122.34 57.35,82.28 55.37,79.31 X1.K 55.37,78.33 55.37,78.32 57.35,75.35 v57.35,13.97
  Bottom 0.254: X4.K arc90 55.37,200.65 55.37,198.84 57.35,195.87 v57.35,195.38 | v57.35,13.97 55.37,11 EC1.K
L  (via drill 0.3)
  Top 0.254: v53.39,195.38 53.39,176.26 51.41,173.29 X3.L 51.41,172.3 53.39,169.33 53.39,129.27 51.41,126.3 X2.L 51.41,125.31 53.39,122.34 53.39,82.28 51.41,79.31 X1.L 51.41,78.33 51.41,78.32 53.39,75.35 v53.39,13.97
  Bottom 0.254: X4.L arc90 51.41,201.29 51.41,198.84 53.39,195.87 v53.39,195.38 | v53.39,13.97 51.41,11 EC1.L
M  (via drill 0.3)
  Top 0.254: v49.43,195.38 49.43,176.26 47.45,173.29 X3.M 47.45,172.3 49.43,169.33 49.43,129.27 47.45,126.3 X2.M 47.45,125.31 49.43,122.34 49.43,82.28 47.45,79.31 X1.M 47.45,78.32 49.43,75.35 v49.43,13.97
  Bottom 0.254: X4.M arc90 47.45,201.29 47.45,198.84 49.43,195.87 v49.43,195.38 | v49.43,13.97 47.45,11 EC1.M
N  (via drill 0.3)
  Top 0.254: v45.47,195.38 45.47,176.26 43.48,173.29 X3.N 43.48,172.3 45.47,169.33 45.47,129.27 43.48,126.3 X2.N 43.49,125.31 43.48,125.31 45.47,122.34 45.47,82.28 43.48,79.31 X1.N 43.49,78.32 43.48,78.32 45.47,75.35 v45.47,13.97
  Bottom 0.254: X4.N arc-90 43.49,201.29 43.48,198.84 45.47,195.87 v45.47,195.38 | EC1.N 43.48,11 v45.47,13.97
N$1
  Bottom 0.254: SW1.12 RP1.6 100.71,78.11 99.44,76.83 53.39,76.83 X1.10
N$2
  Bottom 0.254: SW1.14 RP1.8 111.51,73.03 109.6,71.12 24.51,71.12 21.34,74.3 21.34,79.38 23.24,81.28 25.18,81.28 X1.T
N$3
  Bottom 0.254: SW1.13 RP1.7 111.51,75.56 108.33,72.39 27.05,72.39 25.78,73.66 25.78,76.72 X1.U
N$4
  Bottom 0.254: SW1.11 RP1.5 50.55,80.64 49.91,80.01 49.91,77.32 X1.11
N$5
  Bottom 0.254: SW1.10 RP1.4 48.64,83.19 45.47,80.01 45.47,76.83 X1.12
N$6
  Bottom 0.254: SW1.9 RP1.3 47.37,85.72 41.66,80.01 41.66,76.98 X1.13
N$7
  Bottom 0.254: LED1.A SW1.16
  Bottom 1.27: C1.+ 7.37,74.93 7.85,74.93 X1.21
  pour Bottom (no thermals): 6.83,74.85 arc-90 7.82,75.84 arc-90 8.81,74.85 8.81,71.39 arc90 9.55,70.48 110.87,70.48 115.95,71.12 117.22,71.12 arc-90 117.86,70.48 117.86,67.94 arc-90 117.22,67.31 115.95,67.31 110.87,67.94 8,67.94 arc-90 6.83,69.41
N$8
  Bottom 0.254: LED2.A SW4.16
  Bottom 1.27: C2.+ 7.37,121.92 7.85,121.92 X2.21
  pour Bottom (no thermals): 6.83,121.84 6.83,115.9 arc90 8,114.94 110.87,114.94 115.95,114.3 117.22,114.3 arc90 117.86,114.94 117.86,117.47 arc90 117.22,118.11 115.95,118.11 110.87,117.47 9.55,117.47 arc-90 8.81,118.38 8.81,121.84 arc90 7.82,122.83 arc90
N$9
  Bottom 0.254: SW4.12 RP3.6 100.71,125.09 99.44,123.83 53.39,123.83 X2.10
N$10
  Bottom 0.254: X2.12 45.47,123.83 45.47,127 48.64,130.18 RP3.4 SW4.10
N$11
  Top 0.254: X4.14 35.56,176.26 33.58,173.29 33.58,172.3 35.56,169.33 X3.14
  Bottom 0.254: SW8.8 115.95,184.78 113.41,182.25 RP5.2 46.1,182.25 37.85,173.99 37.85,171.12 X3.14
N$12
  Top 0.254: SW4.13 117.86,122.56 121.03,119.38 121.03,113.67 SW6.1
  Bottom 0.254: SW4.13 RP3.7 | SW6.1 125.48,109.86 126.75,108.58 126.75,104.78 125.48,103.5 124.21,103.5 SW6.6
N$13
  Top 0.254: SW4.14 117.86,120.02 119.76,118.11 119.76,113.03 SW6.4
  Bottom 0.254: SW4.14 RP3.8 | SW6.4 124.21,108.58 125.48,108.58 126.11,107.95 126.11,106.05 SW6.3
N$14
  Top 0.254: X4.15 31.6,176.26 29.62,173.29 29.62,172.3 31.6,169.33 X3.15
  Bottom 0.254: SW8.7 RP6.5 46.74,187.32 33.4,173.99 33.4,170.63 X3.15
N$15
  Bottom 0.254: X2.13 41.66,123.97 41.66,127 47.37,132.72 RP3.3 SW4.9
N$16
  Bottom 0.254: SW4.11 RP3.5 49.91,127.64 49.28,127 49.28,123.67 X2.11
N$17
  Bottom 0.254: R1.2 LED1.K
N$18
  Top 0.254: SW7.13 117.86,169.54 121.03,166.37 121.03,160.66 SW9.1
  Bottom 0.254: SW7.13 RP5.7 | SW9.1 125.48,156.84 126.75,155.57 126.75,151.76 125.48,150.5 124.21,150.5 SW9.6
N$19
  Bottom 0.254: X2.T 27.65,125.69 25.78,123.83 25.78,120.65 27.05,119.38 109.6,119.38 111.51,121.28 117.86,121.28 121.03,118.11 121.03,109.22 SW6.5
N$20
  Top 0.254: X4.12 43.48,176.26 41.5,173.29 41.5,172.3 43.48,169.33 X3.12
  Bottom 0.254: SW7.10 RP5.4 48.64,177.16 45.47,173.99 45.47,170.81 X3.12
N$21
  Top 0.254: X4.13 39.52,176.26 37.54,173.29 37.54,172.3 39.52,169.33 X3.13
  Bottom 0.254: SW7.9 RP5.3 47.37,179.71 41.66,173.99 41.66,170.97 X3.13
N$22
  Bottom 0.254: LED3.A SW7.16
  Bottom 1.27: C3.+ 7.37,165.1 7.85,165.1 X3.21
  pour Bottom (no thermals): 6.83,168.83 6.83,162.89 arc90 8,161.93 110.87,161.93 115.95,161.29 117.22,161.29 arc90 117.86,161.93 117.86,164.47 arc90 117.22,165.1 115.95,165.1 110.87,164.47 9.55,164.47 arc-90 8.81,165.37 8.81,168.83 arc90 7.82,169.82 arc90
  pour Top (no thermals): 6.83,202.59 8.81,202.59 8.81,176.26 6.83,173.29 6.83,172.3 8.81,169.33 8.81,168.83 arc-90 7.82,167.84 arc-90 6.83,168.83 6.83,169.33 4.85,172.3 4.85,173.29 6.83,176.26
N$23
  Bottom 0.254: X2.U 23.69,125.54 21.97,123.83 21.97,120.65 24.51,118.11 110.87,118.11 111.51,118.75 117.86,118.75 119.76,116.84 119.76,108.58 122.3,106.05 123.57,106.05 SW6.2
N$24
  Top 0.254: SW7.14 117.86,167 119.76,165.1 119.76,160.02 SW9.4
  Bottom 0.254: SW7.14 RP5.8 | SW9.4 124.21,155.57 125.48,155.57 126.11,154.94 126.11,153.03 SW9.3
N$25
  Bottom 0.254: R2.2 LED2.K
N$26
  Bottom 0.254: R3.2 LED3.K
N$27  (via drill 0.3)
  Top 0.254: X3.U 23.67,173.29 25.65,176.26 v25.65,195.38
  Bottom 0.254: SW9.2 123.57,153.03 122.3,153.03 119.76,155.57 119.76,163.83 117.86,165.74 111.51,165.74 110.87,165.1 24.51,165.1 21.97,167.64 21.97,171.08 X3.U | v25.65,195.38 25.65,195.87 23.67,198.84 X4.U
N$28  (via drill 0.3)
  Top 0.254: X3.T 27.63,173.29 29.62,176.26 v29.62,195.38
  Bottom 0.254: SW9.5 121.03,156.21 121.03,165.1 117.86,168.28 111.51,168.28 109.6,166.37 27.05,166.37 25.78,167.64 25.78,170.93 X3.T | X4.T arc-90 27.65,201.28 27.63,198.84 29.62,195.87 v29.62,195.38
N$29
  Top 0.254: X4.10 51.41,176.26 49.43,173.29 49.43,172.3 51.41,169.33 X3.10
  Bottom 0.254: SW7.12 RP5.6 101.35,172.09 100.08,170.81 53.39,170.81 X3.10
N$30
  Top 0.254: X4.11 47.45,176.26 45.47,173.29 45.47,172.3 47.45,169.33 X3.11
  Bottom 0.254: SW7.11 RP5.5 49.91,174.62 49.28,173.99 49.28,170.66 X3.11
N$31
  Top 0.254: SW2.8 116.59,89.53 115.32,88.27 RP1.2
  Bottom 0.254: RP1.2 46.1,88.27 37.85,80.01 37.85,77.14 X1.14
N$32
  Bottom 0.254: SW2.7 RP2.5 46.74,93.34 33.4,80.01 33.4,76.65 X1.15
N$33
  Bottom 0.254: SW2.6 RP2.4 45.47,95.89 29.59,80.01 29.59,76.8 X1.16
N$34
  Top 0.254: SW5.8 115.95,137.79 113.41,135.25 RP3.2
  Bottom 0.254: RP3.2 46.1,135.25 37.85,127 37.85,124.12 X2.14
N$35
  Bottom 0.254: X2.15 33.4,123.64 33.4,127 46.74,140.34 RP4.5 SW5.7
N$36
  Bottom 0.254: X2.16 29.59,123.79 29.59,127 45.47,142.88 RP4.4 SW5.6
N$39
  Top 0.254: X4.16 27.63,176.26 25.65,173.29 25.65,172.3 27.63,169.33 X3.16
  Bottom 0.254: SW8.6 RP6.4 45.47,189.87 29.59,173.99 29.59,170.78 X3.16
P  (via drill 0.3)
  Top 0.254: v41.5,195.38 41.5,176.26 39.52,173.29 X3.P 39.52,172.3 41.5,169.33 41.5,129.27 39.52,126.3 X2.P 39.53,125.31 39.52,125.31 41.5,122.34 41.5,82.28 39.52,79.31 X1.P 39.53,78.33 39.52,78.32 41.5,75.35 v41.5,13.97
  Bottom 0.254: X4.P arc-90 39.53,201.29 39.52,198.84 41.5,195.87 v41.5,195.38 | v41.5,13.97 39.52,11 EC1.P
R  (via drill 0.3)
  Top 0.254: v37.54,195.38 37.54,176.26 35.56,173.29 X3.R 35.56,172.3 37.54,169.33 37.54,129.27 35.56,126.3 X2.R 35.57,125.32 35.56,125.31 37.54,122.34 37.54,82.28 35.56,79.31 X1.R 35.57,78.33 35.56,78.32 37.54,75.35 v37.54,13.97
  Bottom 0.254: X4.R arc-90 35.57,201.29 35.56,198.84 37.54,195.87 v37.54,195.38 | v37.54,13.97 35.56,11 EC1.R
S  (via drill 0.3)
  Top 0.254: v33.58,195.38 33.58,176.26 31.6,173.29 X3.S 31.6,172.3 33.58,169.33 33.58,129.27 31.6,126.3 X2.S 31.61,125.32 31.6,125.31 33.58,122.34 33.58,82.28 31.6,79.31 X1.S 31.61,78.33 31.6,78.32 33.58,75.35 v33.58,13.97
  Bottom 0.254: X4.S arc-90 31.61,201.29 31.6,198.84 33.58,195.87 v33.58,195.38 | EC1.S 31.6,11 v33.58,13.97
T  (via drill 0.3)
  Top 0.254: v101.98,66.04 v101.98,76.83 v101.98,123.83 v101.98,170.81 | v29.62,58.52 v29.62,13.97
  Bottom 0.254: v101.98,66.04 100.08,64.14 35.23,64.14 v29.62,58.52 | SW1.3 122.94,73.03 119.13,76.83 v101.98,76.83 | SW4.3 122.94,120.02 119.13,123.83 v101.98,123.83 | SW7.3 122.94,167 119.13,170.81 v101.98,170.81 | EC1.T 27.63,11 v29.62,13.97
U  (via drill 0.3)
  Top 0.254: v100.71,66.67 v100.71,79.38 v100.71,126.36 v100.71,173.35 | v25.65,58.52 v25.65,13.97
  Bottom 0.254: v100.71,66.67 99.44,65.41 32.54,65.41 v25.65,58.52 | SW1.4 122.94,75.56 119.13,79.38 v100.71,79.38 | SW4.4 122.94,122.56 119.13,126.36 v100.71,126.36 | SW7.4 122.94,169.54 119.13,173.35 v100.71,173.35 | EC1.U 23.67,11 v25.65,13.97
V  (via drill 0.3)
  Top 0.254: v21.69,195.38 21.69,176.26 19.71,173.29 X3.V 19.71,172.3 21.69,169.33 21.69,129.27 19.71,126.3 X2.V 19.73,125.3 21.69,122.34 21.69,82.28 19.71,79.31 X1.V 19.73,78.34 19.71,78.32 21.69,75.35 v21.69,13.97
  Bottom 0.254: v21.69,195.38 21.69,195.87 19.71,198.84 X4.V | v21.69,13.97 19.71,11 EC1.V
W  (via drill 0.3)
  Top 0.254: v17.73,195.38 17.73,176.26 15.75,173.29 X3.W 15.75,172.3 17.73,169.33 17.73,129.27 15.75,126.3 X2.W 15.77,125.29 17.73,122.34 17.73,82.28 15.75,79.31 X1.W 15.77,78.34 15.75,78.32 17.73,75.35 v17.73,13.97
  Bottom 0.254: v17.73,195.38 17.73,195.87 15.75,198.84 X4.W | v17.73,13.97 15.75,11 EC1.W
X  (via drill 0.3)
  Top 0.254: v13.77,195.38 13.77,176.76 13.77,176.26 11.79,173.29 X3.X 11.79,172.3 13.77,169.33 13.77,129.27 11.79,126.3 X2.X 11.79,125.31 13.77,122.34 13.77,82.28 11.79,79.31 X1.X 11.81,78.34 11.79,78.32 13.77,75.35 v13.77,13.97
  Bottom 0.254: X4.X 11.79,198.84 13.77,195.87 v13.77,195.38 15.62,193.04 84.84,193.04 92.43,200.63 SW3.2 | v13.77,13.97 11.79,11 EC1.X
Y  (via drill 0.3)
  Top 0.254: v9.8,13.97 SJ2.2 | X1.Y 7.82,78.32 9.8,75.35 SJ2.1 SJ2.2 | X1.Y | X1.Y 7.82,79.31 9.8,82.28 9.8,122.34 7.85,125.29 X2.Y 7.82,126.3 9.8,129.27 9.8,169.33 7.82,172.3 X3.Y 7.82,173.29 9.8,176.26 v9.8,195.38 | SJ2.2 9.8,14.08
  Bottom 0.254: EC1.Y 7.82,11 v9.8,13.97 | v9.8,195.38 9.8,195.87 7.82,198.84 X4.Y

### Text on the board
tValues: RAM3 | RAM2 | RAM1 | BLK5 | BLK3 | BLK2 | BLK1 | IO3 | IO2 | POWER | POWER | NORM | SWAP | NORM | IO2/IO3 | SWAP | RAM3 | RAM2 | RAM1 | BLK5 | BLK3 | BLK2 | BLK1 | IO3 | IO2 | POWER | POWER | NORM | SWAP | NORM | IO2/IO3 | SWAP | RAM3 | RAM2 | RAM1 | BLK5 | BLK3 | BLK2 | BLK1 | IO3 | IO2 | POWER | POWER